# Altium schematic sheet FEV-60_Motor_Driver_Phase1.SchDoc
size B
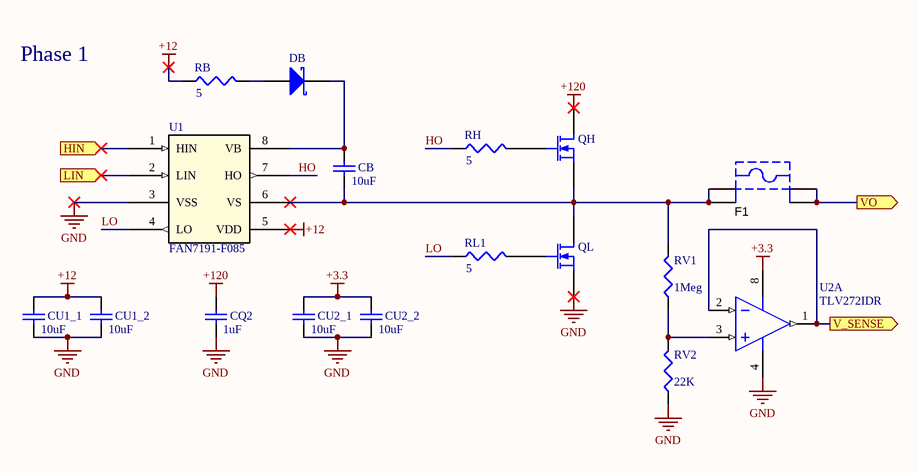
[diagram p0: FEV-60_Motor_Driver_Phase1.SchDoc]

## Parts
CB  value 10uF  [C1206]  (hidden comment: Cap Semi)
CQ2  1uF  [TDK-C5750-2_M]
CU1_1  value 10uF  [1608[0603]]  (hidden comment: Cap Semi)
CU1_2  value 10uF  [1608[0603]]  (hidden comment: Cap Semi)
CU2_1  value 10uF  [1608[0603]]  (hidden comment: Cap Semi)
CU2_2  value 10uF  [1608[0603]]  (hidden comment: Cap Semi)
DB  STPS2200U  [SMB]  (value not drawn)
F1  3568  [KSTN-3568_V]  (value not drawn)
QH  TPH2900ENH  [TPH2900ENH]  (value not drawn)
QL  TPH2900ENH  [TPH2900ENH]  (value not drawn)
RB  value 5  [J1-0603]  (hidden comment: Res3)
RH  value 5  [J1-0603]  (hidden comment: Res3)
RL1  value 5  [J1-0603]  (hidden comment: Res3)
RV1  value 1Meg  [J1-0603]  (hidden comment: Res3)
RV2  value 22K  [J1-0603]  (hidden comment: Res3)
U1  FAN7191-F085  [FAN7191-F085]
U2  TLV272IDR  [D0008A_M]  (part A of 2)

## Ports
HIN (in), LIN (in), V_SENSE (out), VO (out)

## Nets
+3.3: CU2_1.1 CU2_2.1 U2.8(VDD)
+12: CU1_1.1 CU1_2.1 RB.1 U1.5(VDD)
+120: CQ2.1 QH.1(D)
GND: CQ2.2 CU1_1.2 CU1_2.2 CU2_1.2 CU2_2.2 QL.3(S) RV2.1 U1.3(VSS) U2.4(GND)
HIN: U1.1(HIN) ; port HIN
HO: RH.1 U1.7(HO)
LIN: U1.2(LIN) ; port LIN
LO: RL1.1 U1.4(LO)
V_SENSE: U2.1(OUT1) U2.2(IN1-) ; port V_SENSE
VO: F1.3 F1.4 ; port VO
NetCB_1: CB.1 F1.1 F1.2 QH.3(S) QL.1(D) RV1.2 U1.6(VS)
NetCB_2: CB.2 DB.2(K) U1.8(VB)
NetDB_1: DB.1(A) RB.2
NetQH_2: QH.2(G) RH.2
NetQL_2: QL.2(G) RL1.2
NetRV1_1: RV1.1 RV2.2 U2.3(IN1+)

## Notes on the sheet
- Phase 1
- Title
- Date:
- Revision:
- Number:
- Team Skytanic
- Sheet
- of
- Senior Design
- 2019/2020
- File:

## Library data of the parts
CB = Cap Semi: Capacitor (Semiconductor SIM Model) at least 10-20uF; Published: 8-Jun-2000; LatestRevisionDate: 29-May-2009; LatestRevisionNote: IPC-7351 Footprint Added.; PackageReference: C1206; Publisher: Altium Limited; PackageDescription: Chip Capacitor
CQ2 = C5750X7R2E105K230KA: Chip Capacitor, 1 uF, +/- 20%, 250 V, -55 to 125 degC, 2220 (5750 Metric), RoHS, Tape and Reel; PCN Part Number: MLCCPartNumberChange30/Nov/2012; Manufacturer: TDK; Other Names: 445-5212-1; Featured Product: Compact,High-CapacitanceMultilayerCeramicChipCapacitorsMidVoltageX7S-100VMLCCsC-SeriesMidVoltageMLCCs; Product Training Modules: SEAT,CCV,andTVCLDesignToolsCSeriesMidVoltageCapacitorsFamilyGuidetoReplacinganElectrolyticCapacitorwithanMLCC; Kits: 445-9009-KIT-ND-KITCAPCERHICAP100V-630VSMDSAMPLEKIT1008-ND-KITCAPCERMLCC100V-630V; Catalog Drawings: CSERIES_2220_2.5; Online Catalog: CSeries,MidVoltage; Temperature Coefficient: X7S; Voltage - Rated: 100V; Capacitance: 10µF; Package Description: SMD, 2-Leads, Body 6.1 x 5.4 mm; Manufacturer URL: http://www.tdk.com/; Size / Dimension: 0.224"Lx0.197"W(5.70mmx5.00mm); RoHS Information: RoHSCertificate-MLCC; Package Reference: C5750-2; Applications: GeneralPurpose; Datasheet Version: 09/2013; Features: -; Datasheet URL: https://datasheet.ciiva.com/24216/c5750x7s2a106m230kb-265716-24216594.pdf; Standard Package: 1; Lead Spacing: -; Family: CeramicCapacitors; Thickness (Max): 0.098"(2.50mm); Packaging: CutTape(CT); Mounting Technology: SurfaceMount; Lead Style: -; Height - Seated (Max): -; Package / Case: 2220(5750Metric); Series: C; Category: Capacitors; Ratings: -; Operating Temperature: -55°C~125°C; Mounting Type: SurfaceMount,MLCC; Tolerance: ±20%
CU1_1 CU1_2 CU2_1 CU2_2 = Cap Semi: Capacitor (Semiconductor SIM Model); Published: 8-Jun-2000; LatestRevisionDate: 29-May-2009; LatestRevisionNote: IPC-7351 Footprint Added.; PackageReference: C1206; Publisher: Altium Limited; PackageDescription: Chip Capacitor
DB = D Schottky: Schottky Diode; Published: 8-Jun-2000; LatestRevisionDate: 17-Jul-2002; LatestRevisionNote: Re-released for DXP Platform.; PackageReference: SMB; Publisher: Altium Limited; PackageDescription: DO-214-AA/SMB; 2 C-Bend Leads; Body 5.3 x 3.6 mm, inc. leads (LxW); Code_JEDEC: DO-214-AA
F1 = CMP-2000-05464-1: Fuse Holder, 20 A, 500 V, -50 to 145 degC, 4-Pin THD, RoHS; Manufacturer: Keystone; Package Reference: 3568; Datasheet Version: 04/2013; Datasheet URL: https://datasheet.ciiva.com/16294/m60-2p40-16294706.pdf; Manufacturer URL: http://www.keyelco.com/; Mounting Technology: ThroughHole; Package Description: 4-Pin Through Hole Device, Body 16 x 6.73 mm, Pitch 9.9 mm
QH QL = TPH2900ENH: N-Channel 200V 33A (Ta) 78W (Tc) Surface Mount 8-SOP Advance (5x5); Manufacturer: Toshiba; Part Number: TPH2900ENHL1QCT-ND; ComponentLink1Description: TPH2900ENH; ComponentLink1URL: https://www.digikey.com/product-detail/en/toshiba-semiconductor-and-storage/TPH2900ENHL1Q/TPH2900ENHL1QCT-ND/5456291
RB RH RL1 RV1 RV2 = Res3: Resistor; Published: 8-Jun-2000; LatestRevisionDate: 29-May-2009; LatestRevisionNote: IPC-7351 Footprint Added.; PackageReference: J1-0603; Publisher: Altium Limited; PackageDescription: Chip Resistor
U1 = FAN7191-F085: 600 V / 4.5 A, High and Low / Side Automotive Gate / Driver IC; Manufacturer: On Semiconductor; ComponentLink1Description: Datasheet; ComponentLink1URL: https://www.onsemi.com/pub/Collateral/FAN7191_F085-D.PDF; Part Number: FAN7191-F085
U2 = CMP-0272-02013-3: 550 uA/Ch, 3 MHz, Rail-to-Rail Output Operational Amplifier, 2.7 to 16 V, -40 to 125 degC, 8-pin SOIC (D8), Green (RoHS & no Sb/Br); Manufacturer: Texas Instruments; Number of Channels: 2; Total Supply Voltage(Min)(+5V is 5, +/-5V is 10): 2.7; Vio (25C)(Max)(mV): 5; Total Supply Voltage(Max)(+5V is 5, +/-5V is 10): 16; Rating: Catalog; GBW(Typ)(MHz): 2.4; IIB(Max)(pA): 60; Packing: LARGE T&R; Iq per channel(Max)(mA): 0.56; CMRR(Min)(dB): 58; Sub Family: Low Supply Voltage Amplifier (<=2.7V), Precision Amplifier; Slew Rate(Typ)(V/us): 2.1; ComponentLink1Description: Manufacturer URL; PartNumber: TLV272IDR; ComponentLink2URL: http://www.ti.com/lit/ds/symlink/tlv272.pdf; PackageDescription: 8-Pin Plastic Small Outline, Body 4.9 x 3.9 mm, Pitch 1.27 mm; ComponentLink3Description: Package Specification; DatasheetVersion: SLOS351D; ComponentLink1URL: http://www.ti.com/; ComponentLink2Description: Datasheet; PackageVersion: 4040047-3/M, 06/2011; PackageReference: D0008A; Offset Drift(Typ)(uV/C): 2; Eco-Plan: Green (RoHS & no Sb/Br); Code_JEDEC: MS-012; ComponentLink3URL: http://www.ti.com/litv/pdf/msoi002j; Mounting Technology: Surface Mount